# EAGLE schematic rev1 (EAGLE 9.5.1)
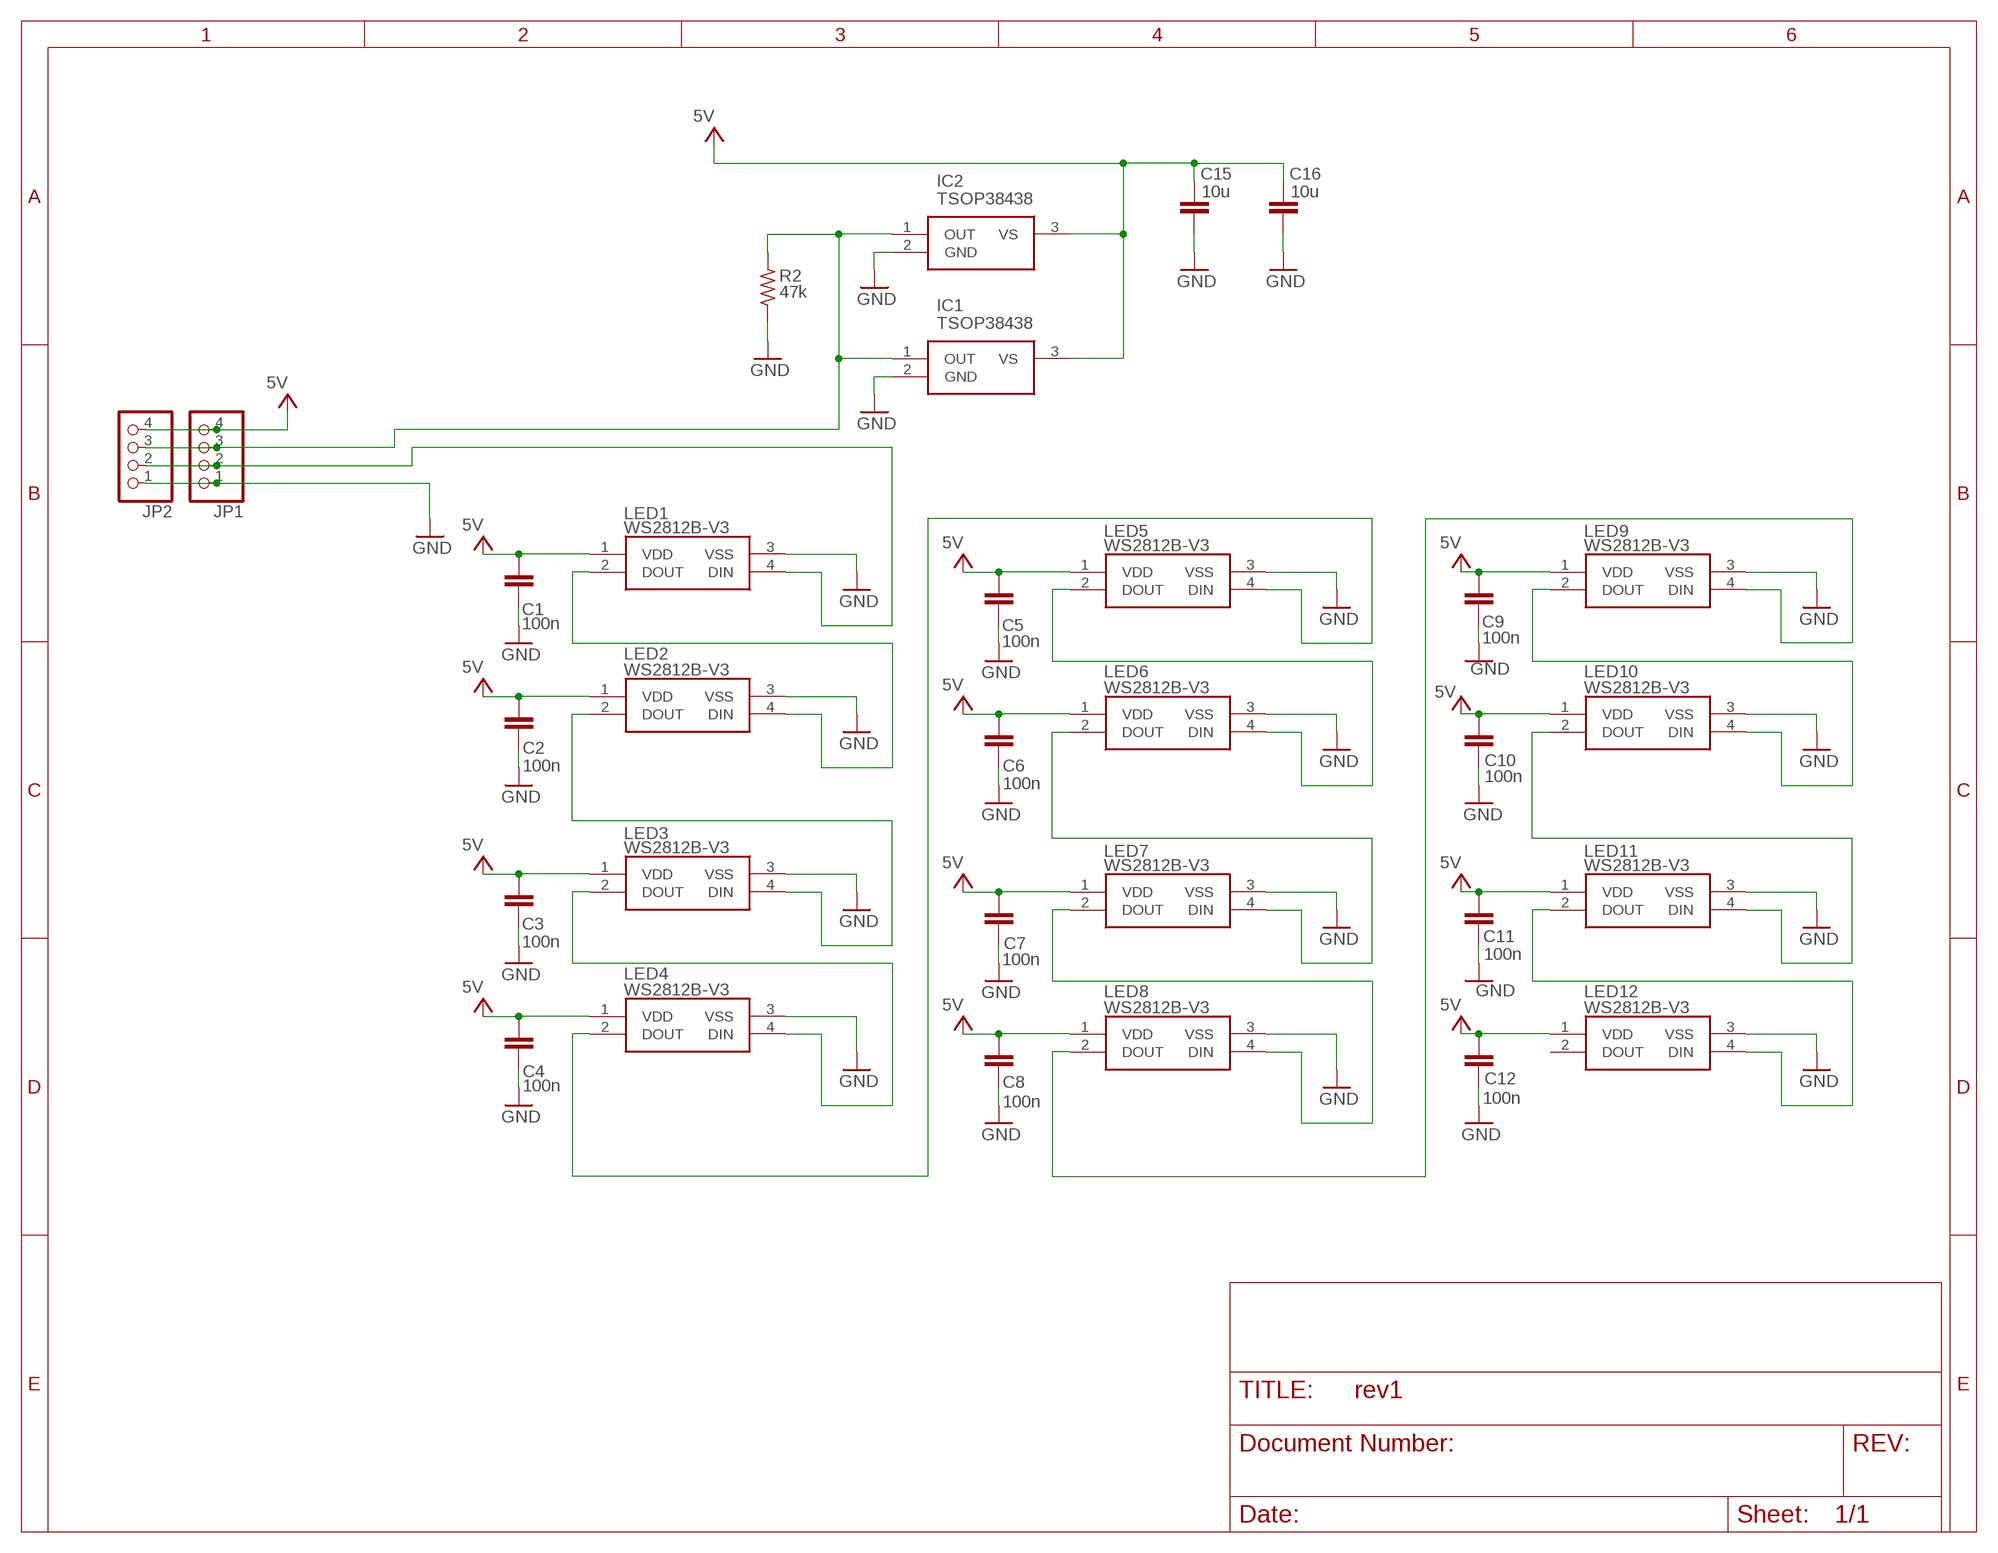
[diagram p0: schematic, sheet 1]

## Parts
C1  100n  CAP_SMD0805  [C0805]
C2  100n  CAP_SMD0805  [C0805]
C3  100n  CAP_SMD0805  [C0805]
C4  100n  CAP_SMD0805  [C0805]
C5  100n  CAP_SMD0805  [C0805]
C6  100n  CAP_SMD0805  [C0805]
C7  100n  CAP_SMD0805  [C0805]
C8  100n  CAP_SMD0805  [C0805]
C9  100n  CAP_SMD0805  [C0805]
C10  100n  CAP_SMD0805  [C0805]
C11  100n  CAP_SMD0805  [C0805]
C12  100n  CAP_SMD0805  [C0805]
C15  10u  CAP_SMD0805  [C0805]
C16  10u  CAP_SMD0805  [C0805]
IC1  TSOP38438  [TSOP38238]
IC2  TSOP38438  [TSOP38238]
JP1  PINHD-1X4  [1X04]
JP2  PINHD-1X4  [1X04]
LED1  WS2812B-V3  [WS2812BV3]
LED2  WS2812B-V3  [WS2812BV3]
LED3  WS2812B-V3  [WS2812BV3]
LED4  WS2812B-V3  [WS2812BV3]
LED5  WS2812B-V3  [WS2812BV3]
LED6  WS2812B-V3  [WS2812BV3]
LED7  WS2812B-V3  [WS2812BV3]
LED8  WS2812B-V3  [WS2812BV3]
LED9  WS2812B-V3  [WS2812BV3]
LED10  WS2812B-V3  [WS2812BV3]
LED11  WS2812B-V3  [WS2812BV3]
LED12  WS2812B-V3  [WS2812BV3]
R2  47k  RES_SMD0805  [R0805]

## Nets
5V: C1.2 C2.1 C3.2 C4.1 C5.2 C6.1 C7.2 C8.1 C9.2 C10.1 C11.2 C12.1 C15.2 C16.2 IC1.3(VS) IC2.3(VS) JP1.4 JP2.4 LED1.1(VDD) LED2.1(VDD) LED3.1(VDD) LED4.1(VDD) LED5.1(VDD) LED6.1(VDD) LED7.1(VDD) LED8.1(VDD) LED9.1(VDD) LED10.1(VDD) LED11.1(VDD) LED12.1(VDD)
GND: C1.1 C2.2 C3.1 C4.2 C5.1 C6.2 C7.1 C8.2 C9.1 C10.2 C11.1 C12.2 C15.1 C16.1 IC1.2(GND) IC2.2(GND) JP1.1 JP2.1 LED1.3(VSS) LED2.3(VSS) LED3.3(VSS) LED4.3(VSS) LED5.3(VSS) LED6.3(VSS) LED7.3(VSS) LED8.3(VSS) LED9.3(VSS) LED10.3(VSS) LED11.3(VSS) LED12.3(VSS) R2.1
N$1: LED1.2(DOUT) LED2.4(DIN)
N$2: IC1.1(OUT) IC2.1(OUT) JP1.3 JP2.3 R2.2
N$3: JP1.2 JP2.2 LED1.4(DIN)
N$4: LED3.2(DOUT) LED4.4(DIN)
N$8: LED2.2(DOUT) LED3.4(DIN)
N$9: LED5.2(DOUT) LED6.4(DIN)
N$12: LED4.2(DOUT) LED5.4(DIN)
N$13: LED7.2(DOUT) LED8.4(DIN)
N$16: LED6.2(DOUT) LED7.4(DIN)
N$17: LED9.2(DOUT) LED10.4(DIN)
N$20: LED8.2(DOUT) LED9.4(DIN)
N$21: LED11.2(DOUT) LED12.4(DIN)
N$24: LED10.2(DOUT) LED11.4(DIN)
Unconnected: LED12.2(DOUT)

## Library data of the parts
C1-C12 C15 C16 = passives:CAP_SMD
IC1 IC2 = WS2812B-V3:TSOP38438: IR Remote Receiver 38KHz 45m Source: Datasheet <http://www.vishay.com/docs/82491/tsop382.pdf>; ALLIED_NUMBER: R1084632; ALLIED_PRICE-STOCK: https://www.alliedelec.com/vishay-dale-tsop38438/R1084632/; DESCRIPTION: IR Remote Receiver 38KHz 45m; HEIGHT: mm; MANUFACTURER_NAME: Vishay; MANUFACTURER_PART_NUMBER: TSOP38438; MOUSER_PART_NUMBER: 78-TSOP38438; MOUSER_PRICE-STOCK: https://www.mouser.com/Search/Refine.aspx?Keyword=78-TSOP38438; RS_PART_NUMBER: 7085092P; RS_PRICE-STOCK: http://uk.rs-online.com/web/p/products/7085092P
JP1 JP2 = WS2812B-V3:PINHD-1X4: PIN HEADER
LED1-LED12 = WS2812B-V3:WS2812B-V3: Light Emitting Diodes (LED) RGB 620~630nm Red, 515~530nm Green, 465~475nm Blue 550~700mcd@20mA Red, 1100~1400mcd@20mA Green, 200~400mcd@20mA Blue Top View 5050 RoHS Source: Datasheet <https://datasheet.lcsc.com/szlcsc/Worldsemi-WS2812B_C114585.pdf>; DESCRIPTION: Light Emitting Diodes (LED) RGB 620~630nm Red, 515~530nm Green, 465~475nm Blue 550~700mcd@20mA Red, 1100~1400mcd@20mA Green, 200~400mcd@20mA Blue Top View 5050 RoHS; HEIGHT: 1.62mm; MANUFACTURER_NAME: Worldsemi; MANUFACTURER_PART_NUMBER: WS2812B-V3
R2 = passives:RES_SMD